# EAGLE design BigMuff (EAGLE 7.7.0)
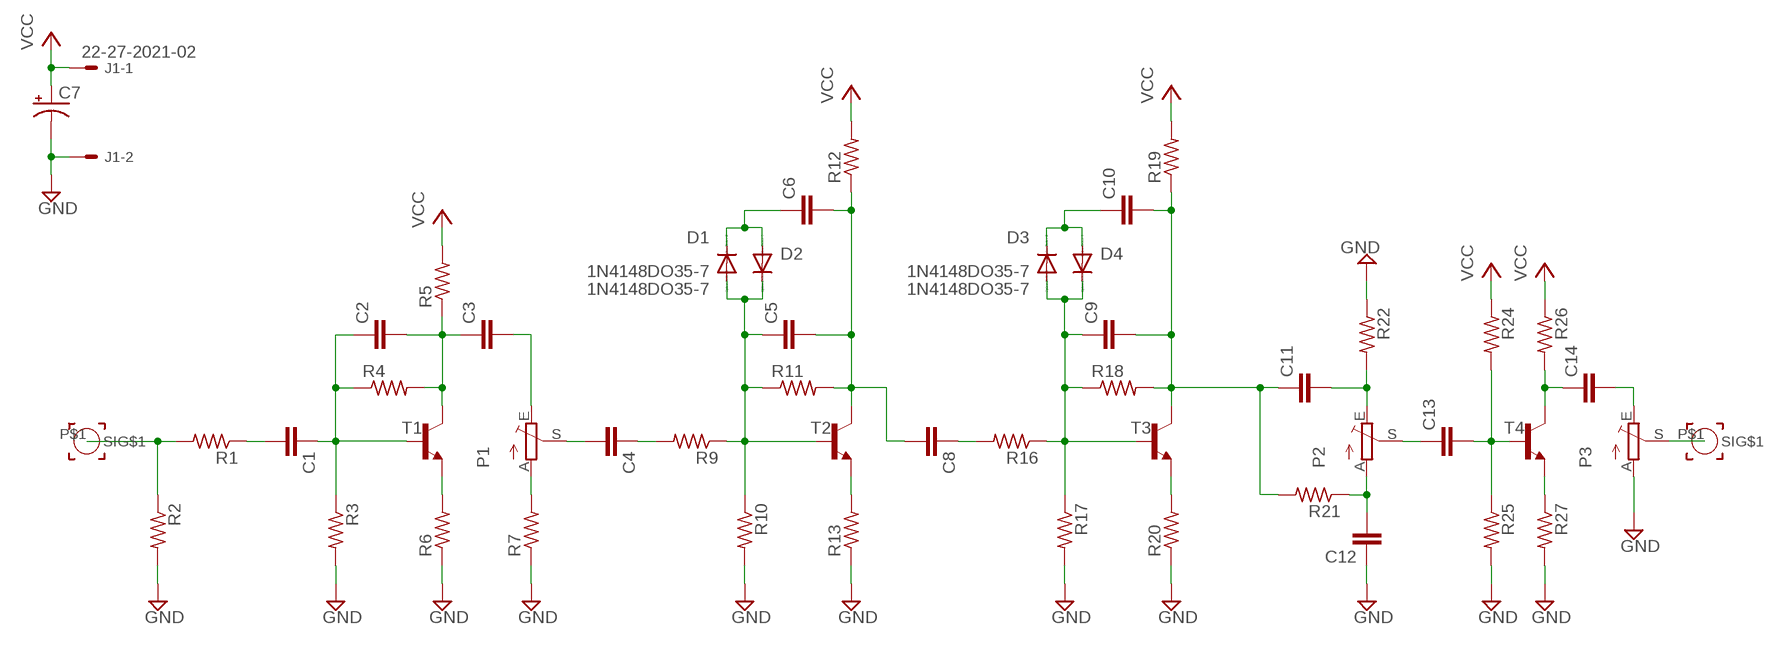
[diagram p0: schematic, sheet 1]

## Parts
C1  C-EU050-024X044-BP  [C050-024X044-BP]
C2  C-EU050-024X044-BP  [C050-024X044-BP]
C3  C-EU050-024X044-BP  [C050-024X044-BP]
C4  C-EU050-024X044-BP  [C050-024X044-BP]
C5  C-EU050-024X044-BP  [C050-024X044-BP]
C6  C-EU050-024X044-BP  [C050-024X044-BP]
C7  CPOL-USE2.5-7  [E2,5-7]
C8  C-EU050-024X044-BP  [C050-024X044-BP]
C9  C-EU050-024X044-BP  [C050-024X044-BP]
C10  C-EU050-024X044-BP  [C050-024X044-BP]
C11  C-EU050-024X044-BP  [C050-024X044-BP]
C12  C-EU050-024X044-BP  [C050-024X044-BP]
C13  C-EU050-024X044-BP  [C050-024X044-BP]
C14  C-EU050-024X044-BP  [C050-024X044-BP]
D1  1N4148DO35-7  [DO35-7]
D2  1N4148DO35-7  [DO35-7]
D3  1N4148DO35-7  [DO35-7]
D4  1N4148DO35-7  [DO35-7]
J1  22-27-2021-02  [6410-02]
P1  TRIM_EU-S64W  [S64W]
P2  TRIM_EU-S64W  [S64W]
P3  TRIM_EU-S64W  [S64W]
R1  R-US_0204/5-BP  [0204/5-BP]
R2  R-US_0204/5-BP  [0204/5-BP]
R3  R-US_0204/5-BP  [0204/5-BP]
R4  R-US_0204/5-BP  [0204/5-BP]
R5  R-US_0204/5-BP  [0204/5-BP]
R6  R-US_0204/5-BP  [0204/5-BP]
R7  R-US_0204/5-BP  [0204/5-BP]
R9  R-US_0204/5-BP  [0204/5-BP]
R10  R-US_0204/5-BP  [0204/5-BP]
R11  R-US_0204/5-BP  [0204/5-BP]
R12  R-US_0204/5-BP  [0204/5-BP]
R13  R-US_0204/5-BP  [0204/5-BP]
R16  R-US_0204/5-BP  [0204/5-BP]
R17  R-US_0204/5-BP  [0204/5-BP]
R18  R-US_0204/5-BP  [0204/5-BP]
R19  R-US_0204/5-BP  [0204/5-BP]
R20  R-US_0204/5-BP  [0204/5-BP]
R21  R-US_0204/5-BP  [0204/5-BP]
R22  R-US_0204/5-BP  [0204/5-BP]
R24  R-US_0204/5-BP  [0204/5-BP]
R25  R-US_0204/5-BP  [0204/5-BP]
R26  R-US_0204/5-BP  [0204/5-BP]
R27  R-US_0204/5-BP  [0204/5-BP]
T1  -NPN-TO92-EBC  [TO92-EBC]
T2  -NPN-TO92-EBC  [TO92-EBC]
T3  -NPN-TO92-EBC  [TO92-EBC]
T4  -NPN-TO92-EBC  [TO92-EBC]
U$1  SIGNAL_PAD  [SIGNAL_PAD]
U$2  SIGNAL_PAD  [SIGNAL_PAD]

## Nets
GND: C7.- C12.1 J1.2 P3.A R2.2 R3.2 R6.1 R7.1 R10.2 R13.1 R17.2 R20.1 R22.1 R25.2 R27.2
N$1: R1.2 R2.1 U$1.P$1(SIG$1)
N$2: C1.2 R1.1
N$3: C1.1 C2.1 R3.1 R4.1 T1.B
N$4: C2.2 C3.1 R4.2 R5.1 T1.C
N$5: R6.2 T1.E
N$6: P1.A R7.2
N$7: C3.2 P1.E
N$8: C4.2 P1.S
N$9: C4.1 R9.2
N$10: C5.1 D1.A D2.C R9.1 R10.1 R11.1 T2.B
N$12: C5.2 C6.2 C8.2 R11.2 R12.1 T2.C
N$13: R13.2 T2.E
N$14: C12.2 P2.A R21.1
N$15: C11.2 P2.E R22.2
N$16: C6.1 D1.C D2.A
N$20: C8.1 R16.2
N$21: C9.1 D3.A D4.C R16.1 R17.1 R18.1 T3.B
N$22: C9.2 C10.2 C11.1 R18.2 R19.1 R21.2 T3.C
N$23: R20.2 T3.E
N$24: C10.1 D3.C D4.A
N$25: C13.1 P2.S
N$26: C13.2 R24.2 R25.1 T4.B
N$27: C14.1 R26.2 T4.C
N$28: R27.1 T4.E
N$29: C14.2 P3.E
N$30: P3.S U$2.P$1(SIG$1)
VCC: C7.+ J1.1 R5.2 R12.2 R19.2 R24.1 R26.1

## Library data of the parts
C1-C6 C8-C14 = rcl:C-EU: CAPACITOR, European symbol
C7 = rcl:CPOL-US: POLARIZED CAPACITOR, American symbol
D1-D4 = diode:1N4148: DIODE high speed (Philips)
J1 = con-molex:22-?-02: CONNECTOR wire to board 2.54 mm (.1 inch) pitch header; OC_FARNELL: unknown; OC_NEWARK: unknown
P1-P3 = pot:TRIM_EU-: POTENTIOMETER
R1-R7 R9-R13 R16-R22 R24-R27 = rcl:R-US_: RESISTOR, American symbol
T1-T4 = transistor:*-NPN-: NPN Transistror BF959 corrected 2008.03.06
U$1 U$2 = SignalPad:SIGNAL_PAD

## Board
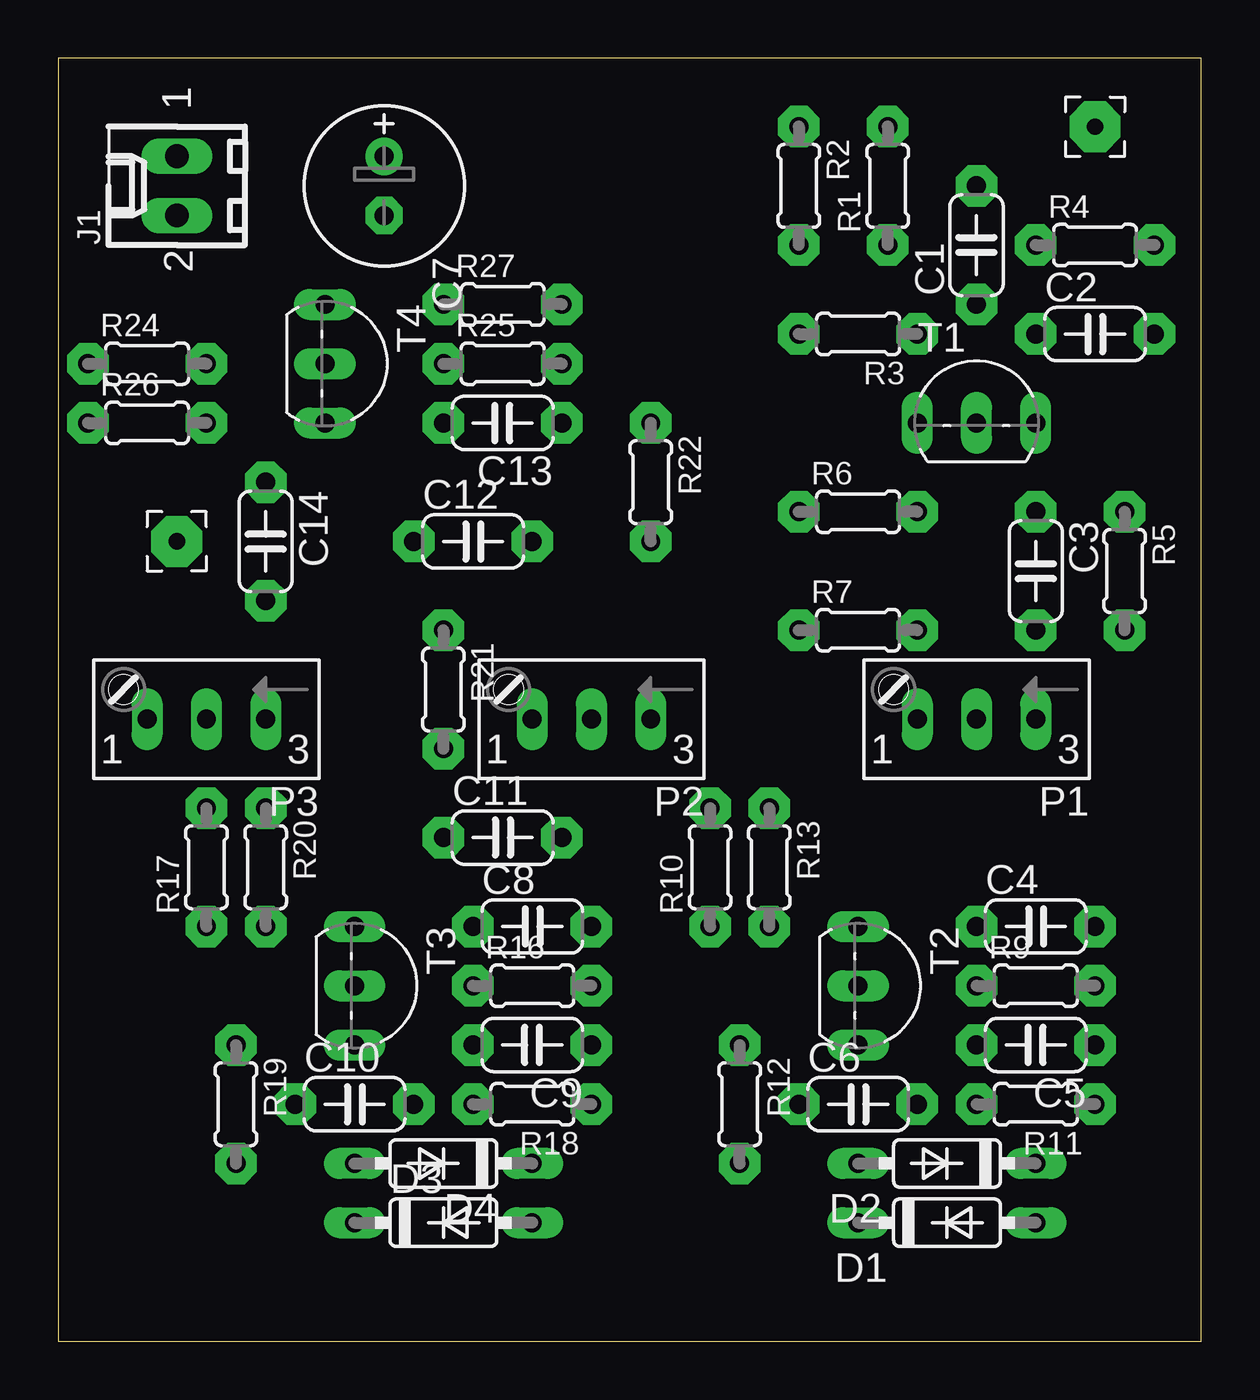
[diagram p1: board, top side]
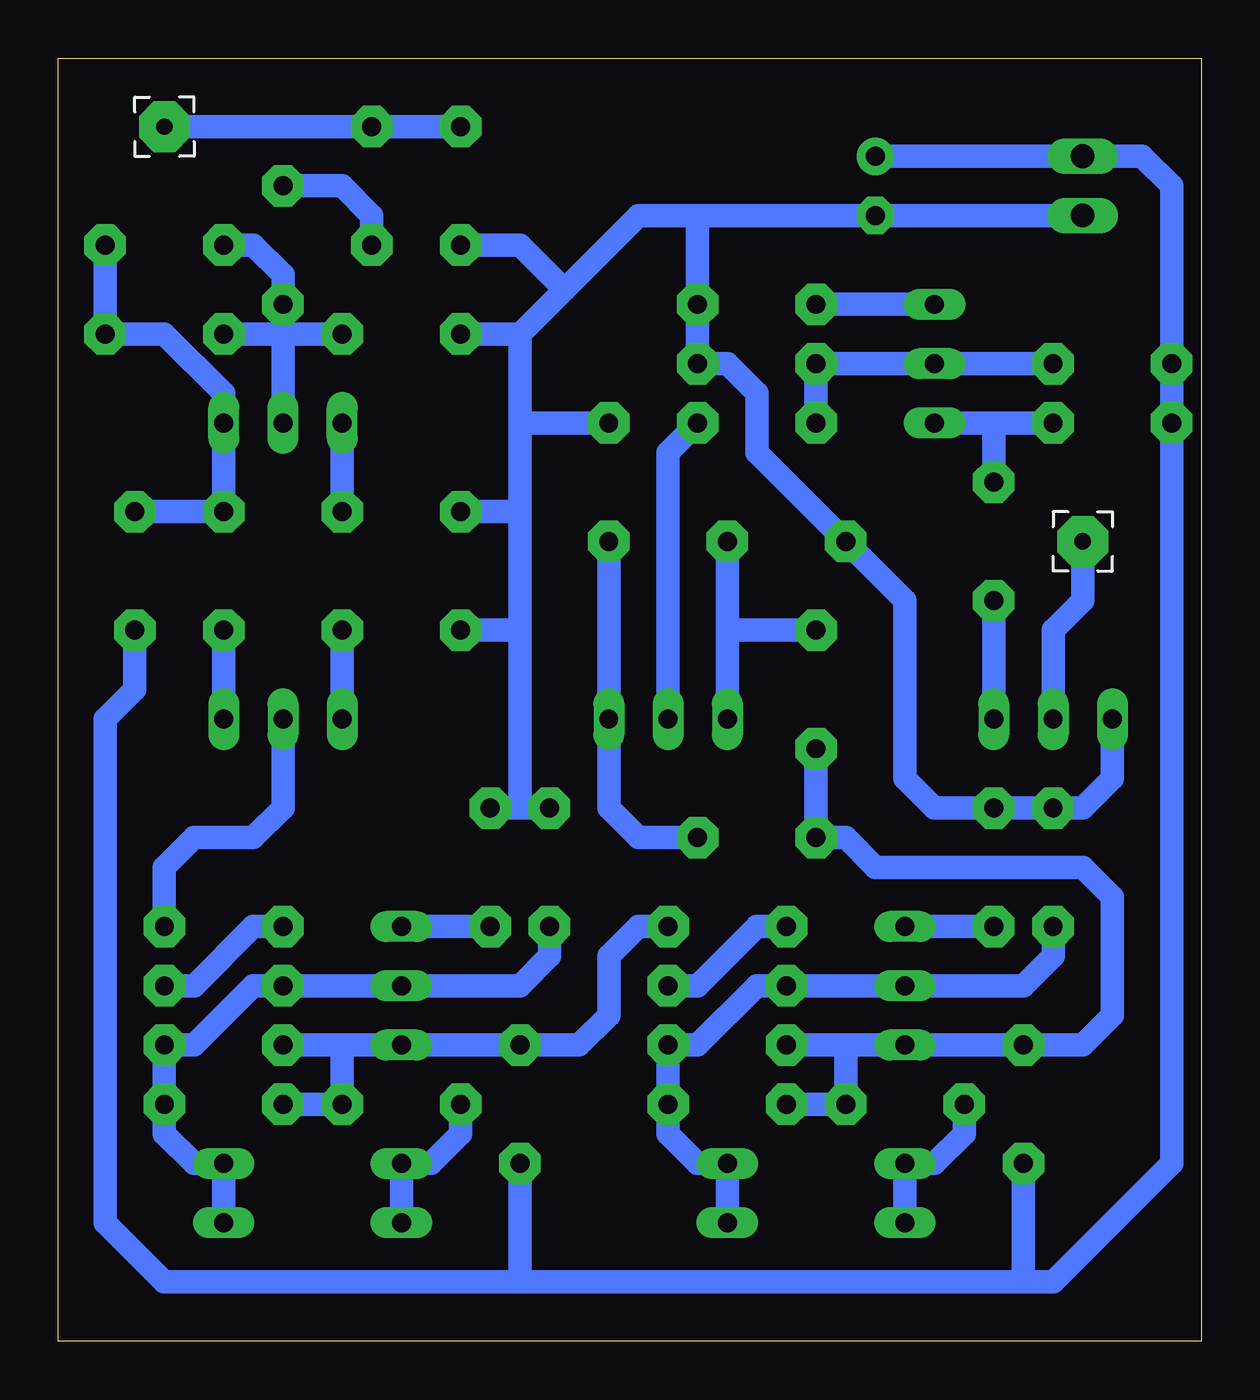
[diagram p2: board, bottom side, seen from below]

Size 49 x 55 mm. Coordinates in mm from the lower left corner, seen from the top.
Outline: 0,0 49,0 49,55 0,55 0,0
Copper layers (1*16): Top 0.035mm / dielectric 1.5mm / Bottom 0.035mm
Design rules "default": minimum track width 10mil, minimum drill 24mil, track to track 8mil, track to pad 8mil, pad to pad 8mil, via to via 8mil, smd to smd 8mil, copper to edge 40mil, drill to drill 8mil, minimum pad ring 10mil, minimum via ring 8mil, stop-mask expansion 4mil, vias tented up to drill 0mil, thermal gap 10mil

### Footprints (pad centres in the part's own frame; a part is rotated, then mirrored left to right if it is on the bottom)
C050-024X044-BP = drill 0.813 pad 1.778 octagon: 1 -2.54,0; 2 2.54,0
E2,5-7 = drill 0.813 pad 1.6: + -1.27,0 | drill 0.813 pad 1.6 octagon: - 1.27,0
DO35-7 = drill 0.813 long: A 3.81,0; C -3.81,0
6410-02 = drill 1.016 long: 1 1.27,0; 2 -1.27,0
S64W = drill 0.813 long: A 2.54,1.27; E -2.54,1.27; S 0,1.27
0204/5-BP = drill 0.813 pad 1.778 octagon: 1 -2.54,0; 2 2.54,0
TO92-EBC = drill 0.813 long: B 0,-1.27; C 2.54,-1.27; E -2.54,-1.27
SIGNAL_PAD = drill 0.7 pad 2.184 octagon: P$1 0,0

### Placement (x,y rotation side)
C1  39.37,46.99 90 top
C2  44.45,43.18 0 top
C3  41.91,33.02 270 top
C4  41.91,17.78 0 top
C5  41.91,12.7 180 top
C6  34.29,10.16 0 top
C7  13.97,49.53 270 top
C8  20.32,17.78 0 top
C9  20.32,12.7 180 top
C10  12.7,10.16 0 top
C11  19.05,21.59 0 top
C12  17.78,34.29 0 top
C13  19.05,39.37 180 top
C14  8.89,34.29 270 top
D1  38.1,5.08 0 top
D2  38.1,7.62 180 top
D3  16.51,5.08 0 top
D4  16.51,7.62 180 top
J1  5.08,49.53 90 top
P1  39.37,27.94 180 top
P2  22.86,27.94 180 top
P3  6.35,27.94 180 top
R1  35.56,49.53 90 top
R2  31.75,49.53 270 top
R3  34.29,43.18 180 top
R4  44.45,46.99 0 top
R5  45.72,33.02 270 top
R6  34.29,35.56 0 top
R7  34.29,30.48 0 top
R9  41.91,15.24 0 top
R10  27.94,20.32 90 top
R11  41.91,10.16 180 top
R12  29.21,10.16 270 top
R13  30.48,20.32 270 top
R16  20.32,15.24 0 top
R17  6.35,20.32 90 top
R18  20.32,10.16 180 top
R19  7.62,10.16 270 top
R20  8.89,20.32 270 top
R21  16.51,27.94 270 top
R22  25.4,36.83 270 top
R24  3.81,41.91 0 top
R25  19.05,41.91 0 top
R26  3.81,39.37 0 top
R27  19.05,44.45 0 top
T1  39.37,40.64 0 top
T2  35.56,15.24 270 top
T3  13.97,15.24 270 top
T4  12.7,41.91 270 top
U$1  44.45,52.07 270 top
U$2  5.08,34.29 180 top

### Tracks (layer width: path | path; a pad name or v marks a point on that pad's centre or on a via)
GND
  Bottom 1.016: R13.1 29.21,22.86 | 29.21,22.86 R10.2 | P3.A 3.81,24.13 5.08,22.86 R17.2 R20.1 11.43,22.86 12.7,24.13 12.7,31.75 C12.1 19.05,38.1 19.05,40.64 20.32,41.91 R25.2 R27.2 21.59,48.26 | 30.48,46.99 R2.2 29.21,46.99 27.3,45.09 | 29.21,43.18 29.21,39.37 | 29.21,39.37 29.21,35.56 | 29.21,35.56 29.21,30.48 | 29.21,30.48 29.21,22.86 | R3.2 29.21,43.18 | R6.1 29.21,35.56 | R7.1 29.21,30.48 | J1.2 C7.- 21.59,48.26 | 21.59,48.26 24.13,48.26 27.3,45.09 | 29.21,43.18 27.3,45.09 | R22.1 29.21,39.37
N$1
  Bottom 1.016: U$1.P$1 R1.2 R2.1
N$2
  Bottom 1.016: C1.2 36.83,49.53 35.56,48.26 R1.1
N$3
  Bottom 1.016: 39.37,43.18 C1.1 39.37,45.72 40.64,46.99 R4.1 | 39.37,43.18 T1.B | R3.1 39.37,43.18 | C2.1 39.37,43.18
N$4
  Bottom 1.016: R5.1 C3.1 T1.C 41.91,40.64 44.45,43.18 C2.2 R4.2
N$5
  Bottom 1.016: T1.E R6.2
N$6
  Bottom 1.016: R7.2 P1.A
N$7
  Bottom 1.016: P1.E C3.2
N$8
  Bottom 1.016: C4.2 44.45,20.32 43.18,21.59 40.64,21.59 39.37,22.86 P1.S
N$9
  Bottom 1.016: C4.1 40.64,17.78 43.18,15.24 R9.2
N$10
  Bottom 1.016: R10.1 27.94,16.51 29.21,15.24 T2.B R9.1 40.64,15.24 43.18,12.7 C5.1 R11.1 44.45,8.89 43.18,7.62 D2.C D1.A
N$12
  Bottom 1.016: R11.2 C6.2 36.83,12.7 | C8.2 24.13,17.78 25.4,16.51 25.4,13.97 26.67,12.7 R12.1 T2.C 36.83,12.7 | C5.2 36.83,12.7
N$13
  Bottom 1.016: R13.2 T2.E
N$14
  Bottom 1.016: P2.A 20.32,30.48 | 20.32,30.48 C12.2 | R21.1 20.32,30.48
N$15
  Bottom 1.016: C11.2 24.13,21.59 25.4,22.86 P2.E R22.2
N$16
  Bottom 1.016: D1.C D2.A 33.02,7.62 31.75,8.89 C6.1
N$20
  Bottom 1.016: R16.2 21.59,15.24 19.05,17.78 C8.1
N$21
  Bottom 1.016: D3.A D4.C 21.59,7.62 22.86,8.89 R18.1 C9.1 21.59,12.7 19.05,15.24 R16.1 T3.B 7.62,15.24 6.35,16.51 R17.1
N$22
  Bottom 1.016: R18.2 C10.2 15.24,12.7 | R21.2 C11.1 15.24,21.59 13.97,20.32 5.08,20.32 3.81,19.05 3.81,13.97 5.08,12.7 R19.1 T3.C 15.24,12.7 | C9.2 15.24,12.7
N$23
  Bottom 1.016: T3.E R20.2
N$24
  Bottom 1.016: D3.C D4.A 11.43,7.62 10.16,8.89 C10.1
N$25
  Bottom 1.016: C13.1 22.86,38.1 P2.S
N$26
  Bottom 1.016: C13.2 R25.1 T4.B R24.2
N$27
  Bottom 1.016: T4.C 8.89,39.37 | 8.89,39.37 R26.2 | C14.1 8.89,39.37
N$28
  Bottom 1.016: R27.1 T4.E
N$29
  Bottom 1.016: C14.2 P3.E
N$30
  Bottom 1.016: P3.S 6.35,30.48 5.08,31.75 U$2.P$1
VCC
  Bottom 1.016: R12.2 29.21,2.54 | 29.21,2.54 7.62,2.54 | 7.62,2.54 6.35,2.54 1.27,7.62 R26.1 R24.1 1.27,49.53 2.54,50.8 J1.1 C7.+ | 7.62,2.54 R19.2 | R5.2 45.72,27.94 46.99,26.67 46.99,5.08 44.45,2.54 29.21,2.54